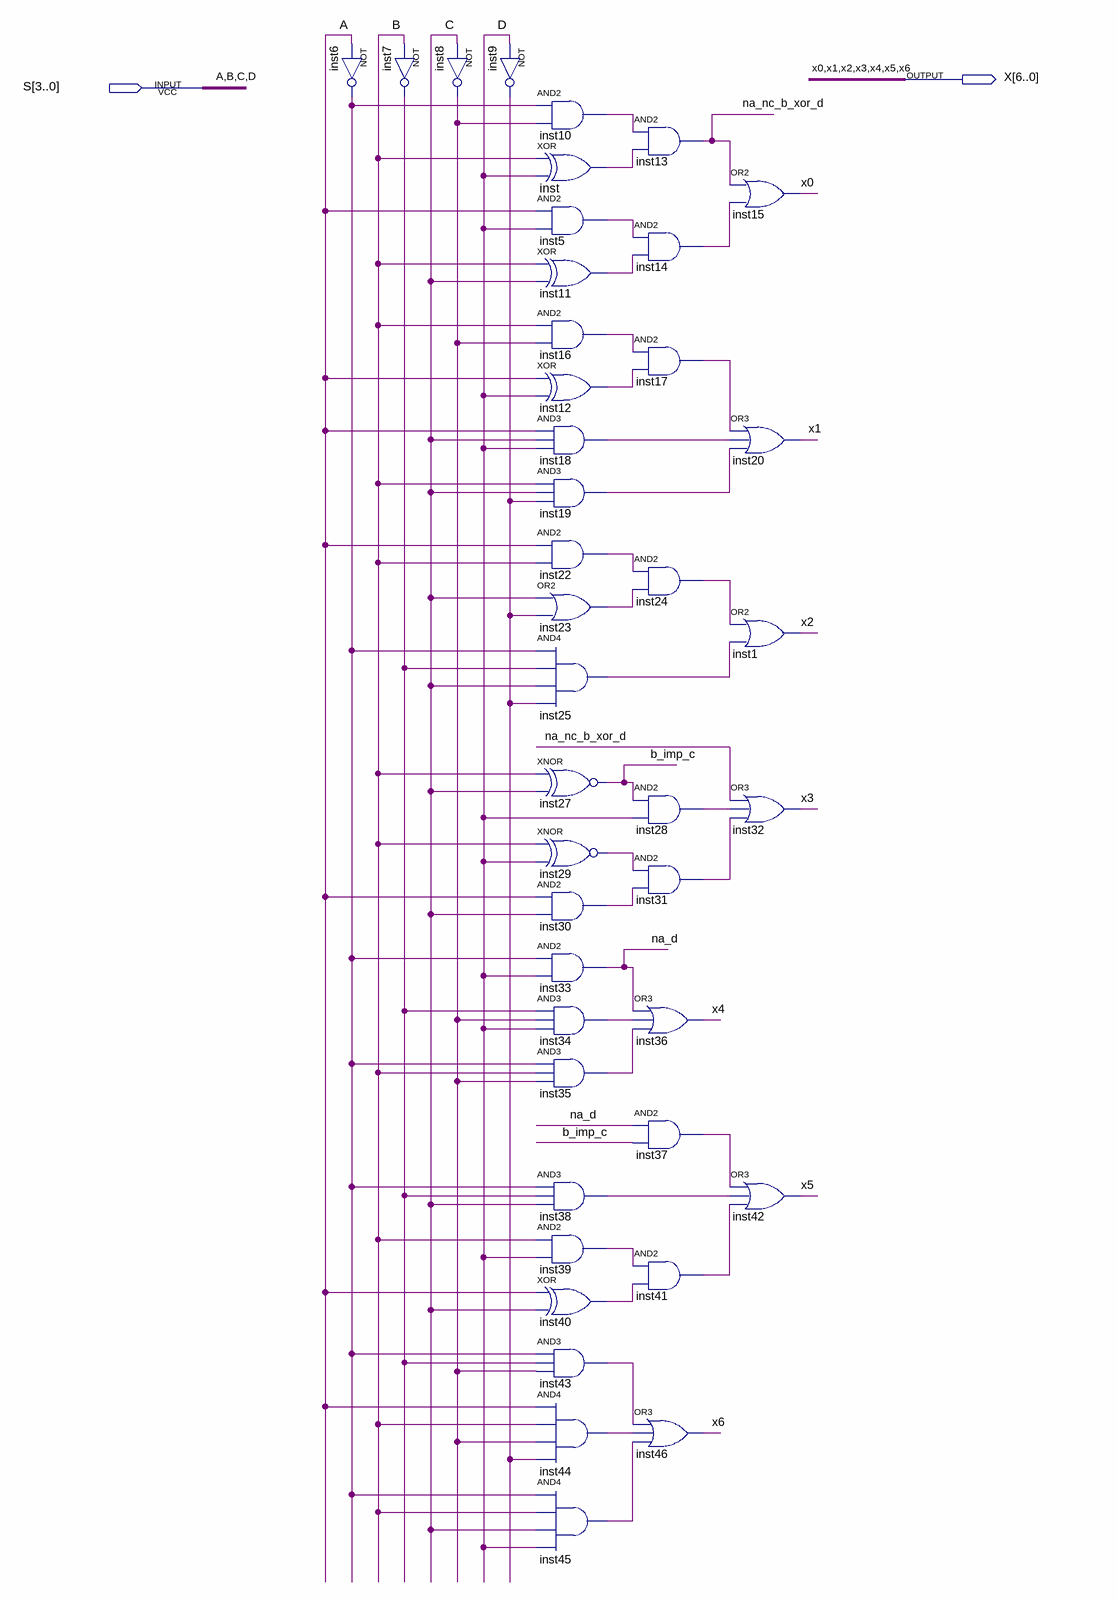
[diagram p0: schematic sheet]
// Quartus schematic digit.bdf as structural Verilog: 42 symbols, 2 pins
module digit (
  input  [3:0] S,
  output [6:0] X
);

  wire b_imp_c, inst5_out, inst6_out, inst7_out, inst8_out, inst9_out, inst10_out, inst11_out, inst12_out,
       inst14_out, inst16_out, inst17_out, inst18_out, inst19_out, inst22_out, inst23_out, inst24_out,
       inst25_out, inst28_out, inst29_out, inst30_out, inst31_out, inst34_out, inst35_out, inst37_out,
       inst38_out, inst39_out, inst40_out, inst41_out, inst43_out, inst44_out, inst45_out, inst_out, na_d,
       na_nc_b_xor_d;

  not inst6 (inst6_out, S[3]);
  not inst7 (inst7_out, S[2]);
  not inst8 (inst8_out, S[1]);
  not inst9 (inst9_out, S[0]);
  and inst10 (inst10_out, inst6_out, inst8_out);
  xor inst (inst_out, S[2], S[0]);
  and inst5 (inst5_out, S[3], S[0]);
  xor inst11 (inst11_out, S[2], S[1]);
  and inst16 (inst16_out, S[2], inst8_out);
  xor inst12 (inst12_out, S[3], S[0]);
  and inst18 (inst18_out, S[3], S[1], S[0]);
  and inst19 (inst19_out, S[2], S[1], inst9_out);
  and inst22 (inst22_out, S[3], S[2]);
  or inst23 (inst23_out, S[1], inst9_out);
  and inst25 (inst25_out, inst6_out, inst7_out, S[1], inst9_out);
  xnor inst27 (b_imp_c, S[2], S[1]);
  xnor inst29 (inst29_out, S[2], S[0]);
  and inst30 (inst30_out, S[3], S[1]);
  and inst33 (na_d, inst6_out, S[0]);
  and inst34 (inst34_out, inst7_out, inst8_out, S[0]);
  and inst35 (inst35_out, inst6_out, S[2], inst8_out);
  and inst38 (inst38_out, inst6_out, inst7_out, S[1]);
  and inst39 (inst39_out, S[2], S[0]);
  xor inst40 (inst40_out, S[3], S[1]);
  and inst43 (inst43_out, inst6_out, inst7_out, inst8_out);
  and inst44 (inst44_out, S[3], S[2], inst8_out, inst9_out);
  and inst45 (inst45_out, inst6_out, S[2], S[1], S[0]);
  and inst13 (na_nc_b_xor_d, inst10_out, inst_out);
  and inst14 (inst14_out, inst5_out, inst11_out);
  and inst17 (inst17_out, inst16_out, inst12_out);
  and inst24 (inst24_out, inst22_out, inst23_out);
  and inst28 (inst28_out, b_imp_c, S[0]);
  and inst31 (inst31_out, inst29_out, inst30_out);
  or inst36 (X[4], na_d, inst34_out, inst35_out);
  and inst37 (inst37_out, na_d, b_imp_c);
  and inst41 (inst41_out, inst39_out, inst40_out);
  or inst46 (X[6], inst43_out, inst44_out, inst45_out);
  or inst15 (X[6], na_nc_b_xor_d, inst14_out);
  or inst20 (X[5], inst17_out, inst18_out, inst19_out);
  or inst1 (X[4], inst24_out, inst25_out);
  or inst32 (X[3], na_nc_b_xor_d, inst28_out, inst31_out);
  or inst42 (X[5], inst37_out, inst38_out, inst41_out);

  assign X[2:0] = {X[4], X[5], X[6]};

  // Other names for the same wires on the sheet: A = S[3]; B = S[2]; C = S[1]; D = S[0]; x2 = X[4]; x1 = X[5];
  //   x0 = X[6]
endmodule
